# EAGLE design Versa64Cart_v1_4 (EAGLE 9.2.2)
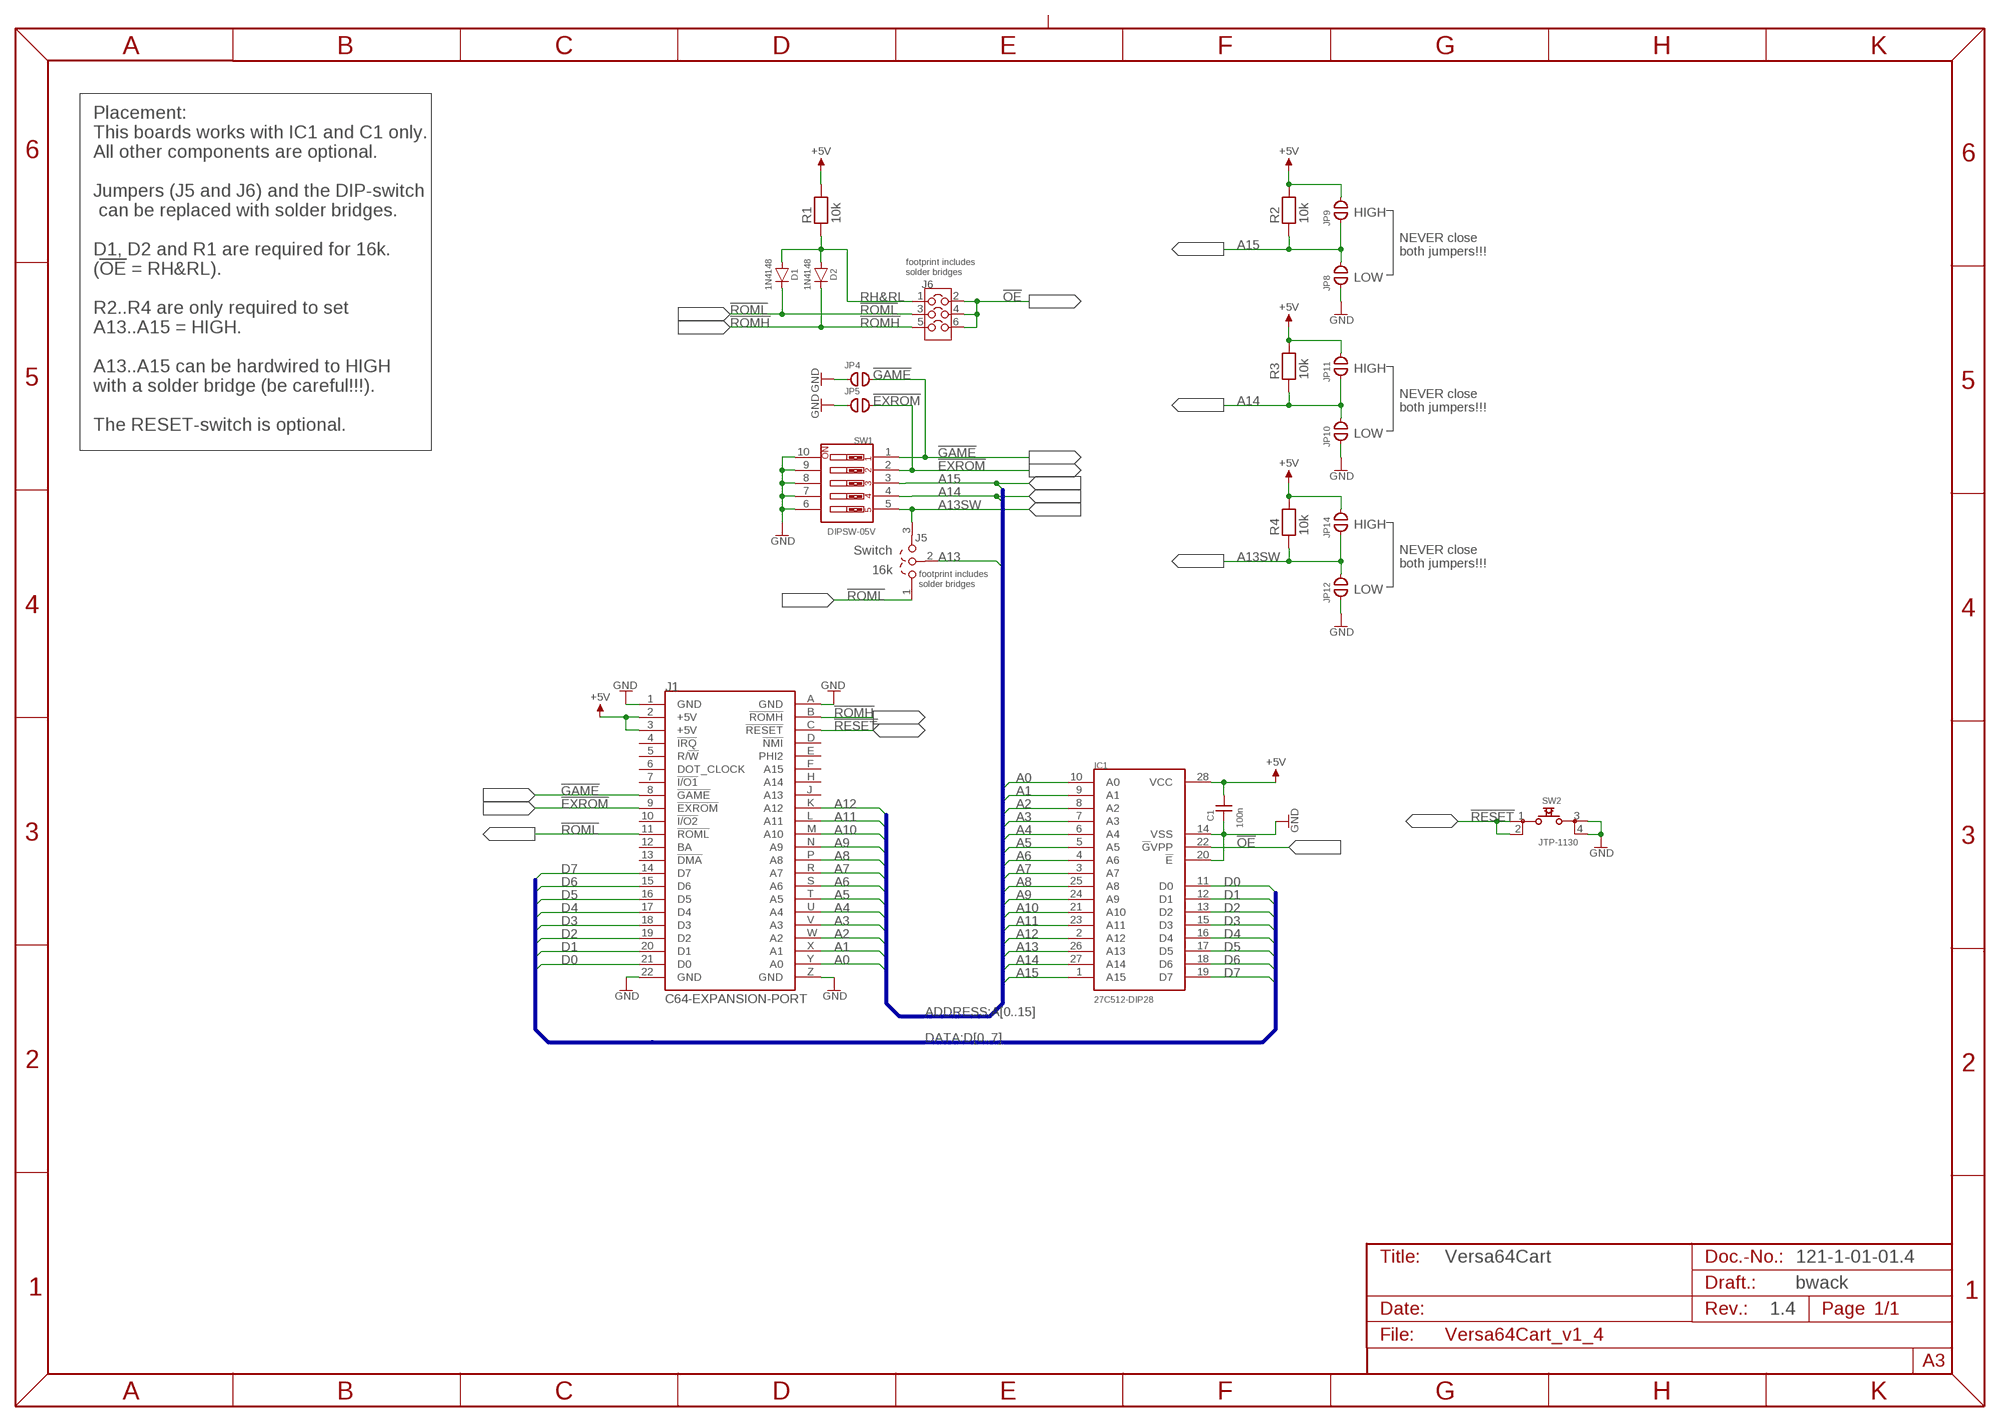
[diagram p0: schematic, sheet 1]

## Parts
C1  100n  CAP01  [C-2,5]
D1  1N4148  [DO-35]
D2  1N4148  [DO-35]
IC1  27C512-DIP28  M27C512-DIP28  [DIL28-6]
J1  C64-EXPANSION-PORT  C64-EXPANSIONPNARROW  [EXPANSIO_SQ]
J5  COMBI-3P  [COMBI-3P]
J6  COMBI-3X2P  [COMBI-3X2]
JP4  OPEN  [CP_OP]
JP5  OPEN  [CP_OP]
JP8  OPEN  [CP_OP]
JP9  OPEN  [CP_OP]
JP10  OPEN  [CP_OP]
JP11  OPEN  [CP_OP]
JP12  OPEN  [CP_OP]
JP14  OPEN  [CP_OP]
R1  10k  RES04  [R-10]
R2  10k  RES04  [R-10]
R3  10k  RES04  [R-10]
R4  10k  RES04  [R-10]
SW1  DIPSW-05V  [DIPSW-05V]
SW2  JTP-1130  [JTP-1130]

## Nets
!EXROM: J1.9(!EXROM) JP5.2 SW1.2
!GAME: J1.8(!GAME) JP4.2 SW1.1
!OE: IC1.22(!G!VPP) J6.2 J6.4 J6.6
!RESET: J1.C(!RESET) SW2.1 SW2.2
!ROMH: D2.K J1.B(!ROMH) J6.5
!ROML: D1.K J1.11(!ROML) J5.1 J6.3
+5V: C1.2 IC1.28(VCC) J1.2(+5V) J1.3(+5V) JP9.2 JP11.2 JP14.2 R1.2 R2.2 R3.2 R4.2
A0: IC1.10(A0) J1.Y(A0)
A1: IC1.9(A1) J1.X(A1)
A2: IC1.8(A2) J1.W(A2)
A3: IC1.7(A3) J1.V(A3)
A4: IC1.6(A4) J1.U(A4)
A5: IC1.5(A5) J1.T(A5)
A6: IC1.4(A6) J1.S(A6)
A7: IC1.3(A7) J1.R(A7)
A8: IC1.25(A8) J1.P(A8)
A9: IC1.24(A9) J1.N(A9)
A10: IC1.21(A10) J1.M(A10)
A11: IC1.23(A11) J1.L(A11)
A12: IC1.2(A12) J1.K(A12)
A13: IC1.26(A13) J5.2
A13SW: J5.3 JP12.2 JP14.1 R4.1 SW1.5
A14: IC1.27(A14) JP10.2 JP11.1 R3.1 SW1.4
A15: IC1.1(A15) JP8.2 JP9.1 R2.1 SW1.3
D0: IC1.11(D0) J1.21(D0)
D1: IC1.12(D1) J1.20(D1)
D2: IC1.13(D2) J1.19(D2)
D3: IC1.15(D3) J1.18(D3)
D4: IC1.16(D4) J1.17(D4)
D5: IC1.17(D5) J1.16(D5)
D6: IC1.18(D6) J1.15(D6)
D7: IC1.19(D7) J1.14(D7)
GND: C1.1 IC1.14(VSS) IC1.20(!E) J1.1(GND) J1.22(GND) J1.A(GND) J1.Z(GND) JP4.1 JP5.1 JP8.1 JP10.1 JP12.1 SW1.6 SW1.7 SW1.8 SW1.9 SW1.10 SW2.3 SW2.4
RH&RL: D1.A D2.A J6.1 R1.1
Unconnected: J1.4(!IRQ) J1.5(R/!W) J1.6(DOT_CLOCK) J1.7(!I/O1) J1.10(!I/O2) J1.12(BA) J1.13(!DMA) J1.D(!NMI) J1.E(PHI2) J1.F(A15) J1.H(A14) J1.J(A13)

## Buses
DATA:D[0..7]
ADDRESS:A[0..15]

## Notes on the sheet
- HIGH
- NEVER close
  both jumpers!!!
- footprint includes
  solder bridges
- LOW
- HIGH
- NEVER close
  both jumpers!!!
- Placement:
  This boards works with IC1 and C1 only. 
  All other components are optional.
  
  Jumpers (J5 and J6) and the DIP-switch
   can be replaced with solder bridges.
  
  D1, D2 and R1 are required for 16k. 
  (!OE! = RH&RL).
  
  R2..R4 are only required to set
  A13..A15 = HIGH.
  
  A13..A15 can be hardwired to HIGH 
  with a solder bridge (be careful!!!).
  
  The RESET-switch is optional.
- LOW
- HIGH
- Switch
- NEVER close
  both jumpers!!!
- 16k
- footprint includes
  solder bridges
- LOW
- Versa64Cart | 121-1-01-01.4
- bwack
- 1.4

## Library data of the parts
C1 = DISCRETE:CAP01
D1 D2 = Dioden:1N4148
IC1 = ST:M27C512
J1 = Commodore:C64-EXPANSIONP
J5 = Cutpad:COMBI-3P
J6 = Cutpad:COMBI-3X2P; SPICEPREFIX: X
JP4 JP5 JP8-JP12 JP14 = Cutpad:OPEN: open Cutpad
R1-R4 = DISCRETE:RES04
SW1 = DIPSWITCH:DIPSW-05
SW2 = Namae_Electronics:JTP-1130

## Board
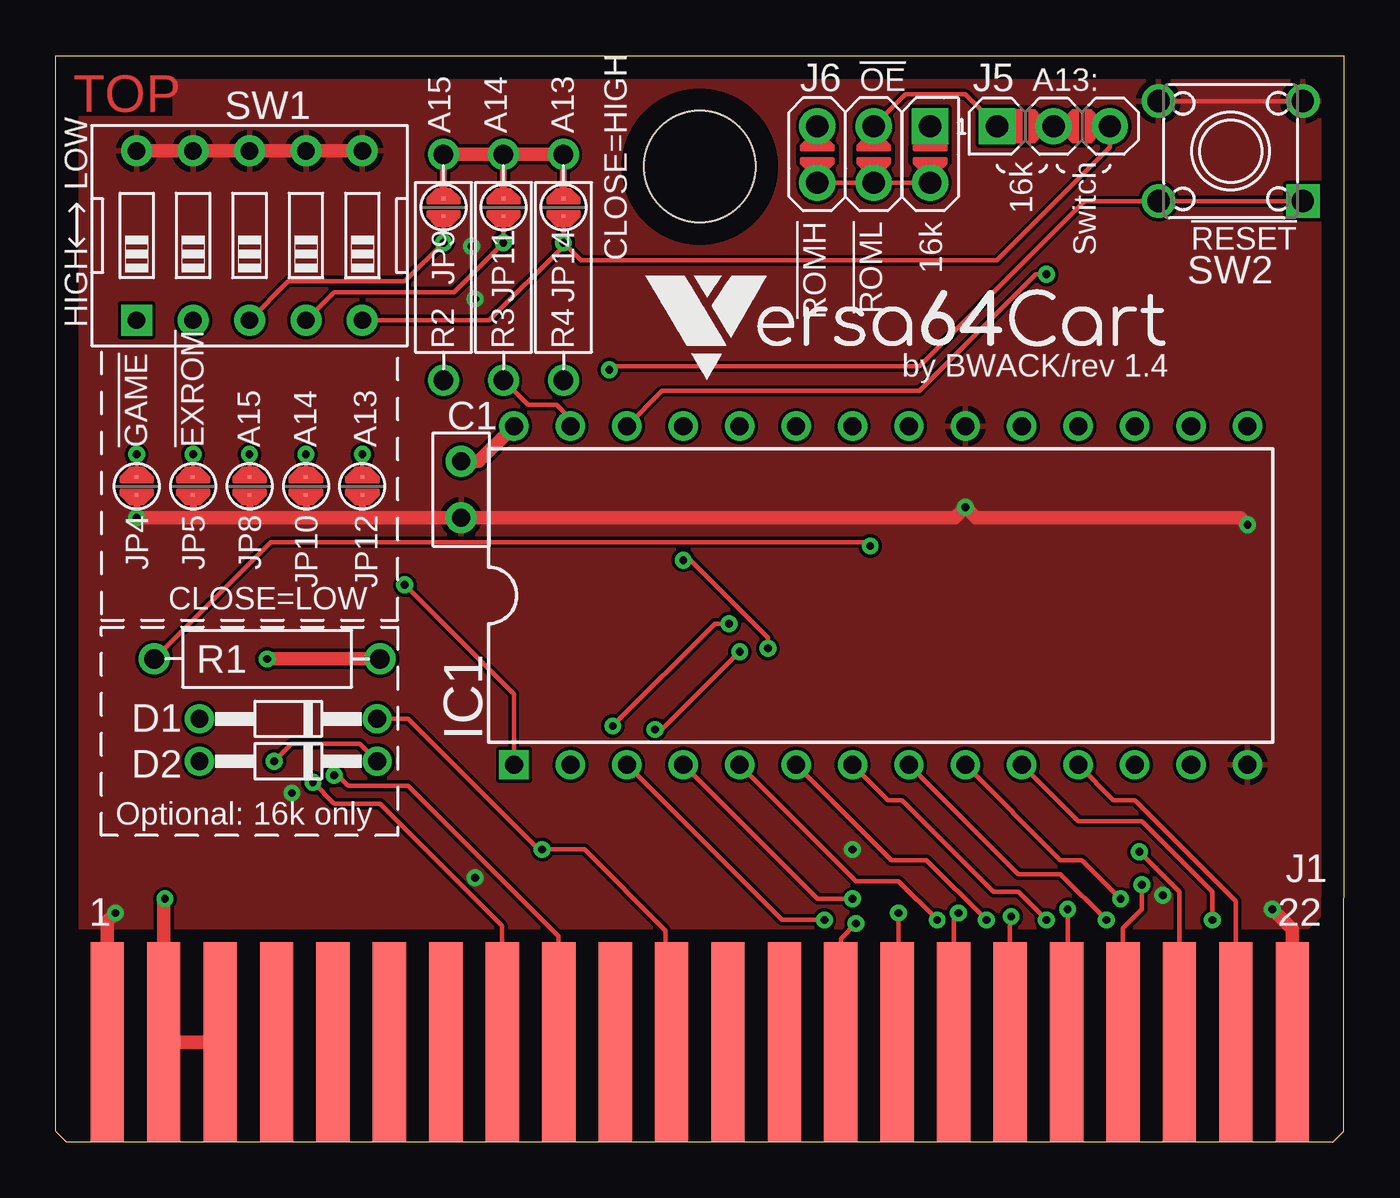
[diagram p1: board, top side]
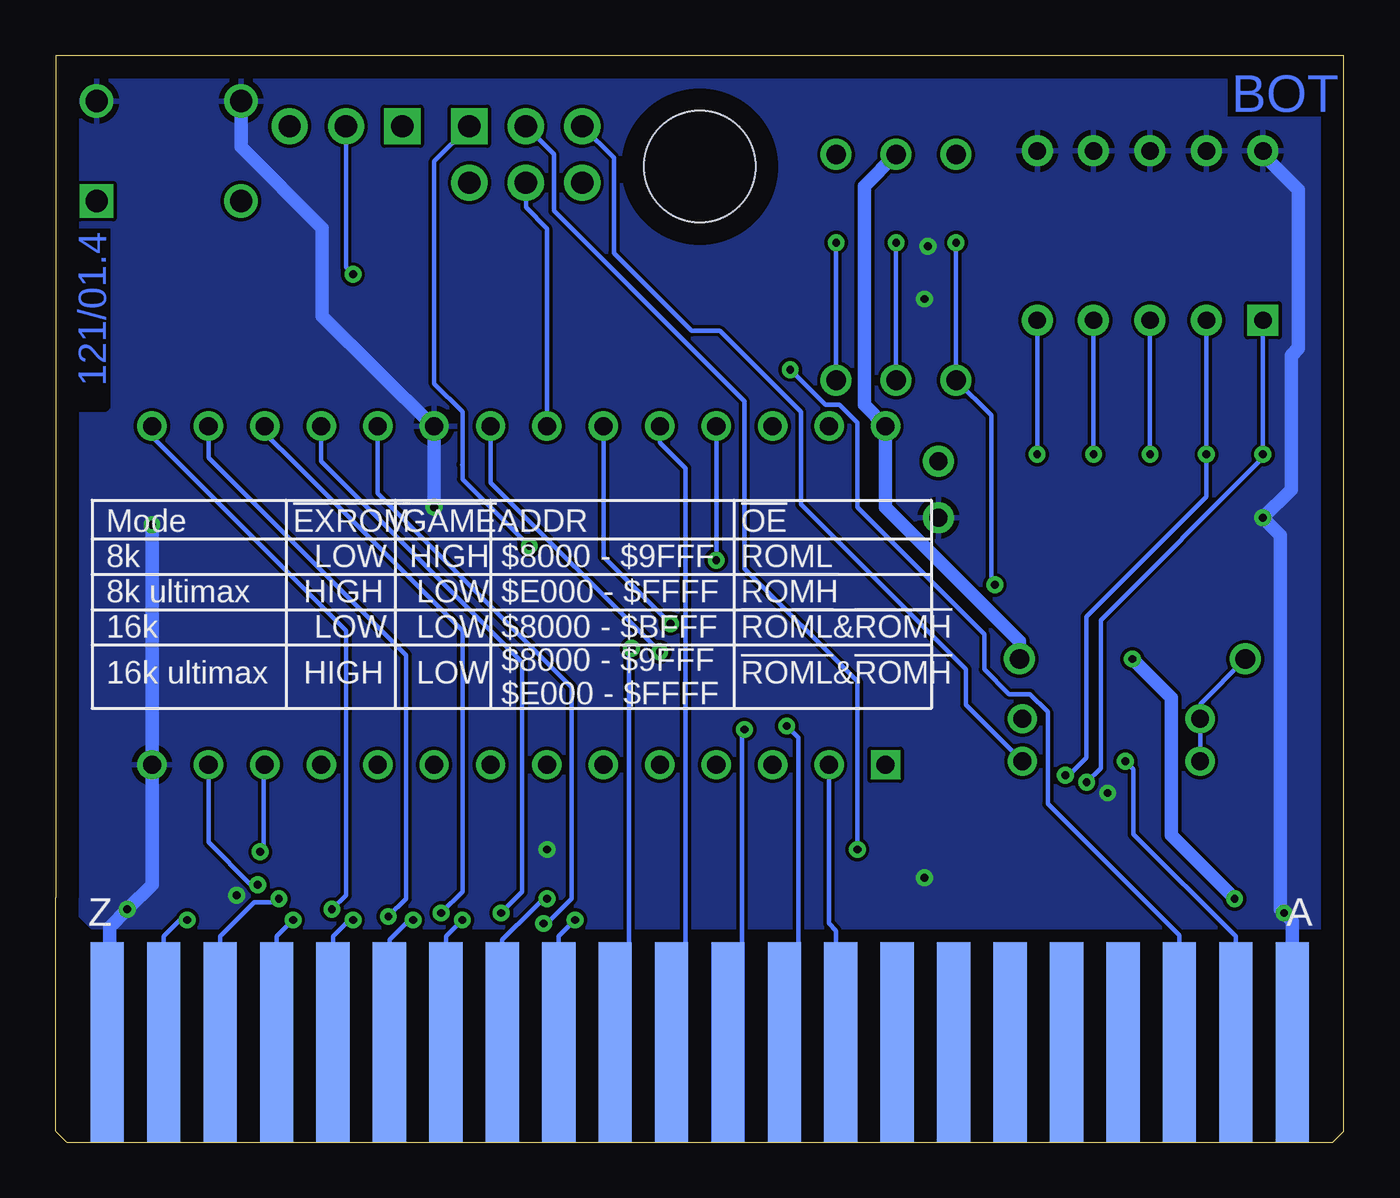
[diagram p2: board, bottom side, seen from below]

Size 58 x 48.9 mm. Coordinates in mm from the lower left corner, seen from the top.
Outline: 0,11 0,48.9 58,48.9 58,11
Copper layers (1*16): Top 0.035mm / dielectric 1.5mm / Bottom 0.035mm
Design rules "default *": minimum track width 6mil, minimum drill 0.35mm, track to track 6mil, track to pad 6mil, pad to pad 6mil, via to via 6mil, smd to smd 6mil, copper to edge 40mil, drill to drill 6mil, minimum pad ring 10mil, minimum via ring 8mil, stop-mask expansion 4mil, vias tented up to drill 24mil, thermal gap 10mil
Holes 5 mm at 29,43.9
bRestrict: 3 lines

### Footprints (pad centres in the part's own frame; a part is rotated, then mirrored left to right if it is on the bottom)
C-2,5 = drill 0.8 pad 1.397: 1 -1.27,0; 2 1.27,0
DO-35 = drill 0.8: A -4,0; K 4,0
DIL28-6 = drill 0.813 square: 1 -16.51,-7.62 | drill 0.813: 2 -13.97,-7.62; 3 -11.43,-7.62; 4 -8.89,-7.62; 5 -6.35,-7.62; 6 -3.81,-7.62; 7 -1.27,-7.62; 8 1.27,-7.62; 9 3.81,-7.62; 10 6.35,-7.62; 11 8.89,-7.62; 12 11.43,-7.62; 13 13.97,-7.62; 14 16.51,-7.62; 15 16.51,7.62; 16 13.97,7.62; 17 11.43,7.62; 18 8.89,7.62; 19 6.35,7.62; 20 3.81,7.62; 21 1.27,7.62; 22 -1.27,7.62; 23 -3.81,7.62; 24 -6.35,7.62; 25 -8.89,7.62; 26 -11.43,7.62; 27 -13.97,7.62; 28 -16.51,7.62
EXPANSIO_SQ = smd 1.5 x 9: 1 26.67,-4.5; 2 24.13,-4.5; 3 21.59,-4.5; 4 19.05,-4.5; 5 16.51,-4.5; 6 13.97,-4.5; 7 11.43,-4.5; 8 8.89,-4.5; 9 6.35,-4.5; 10 3.81,-4.5; 11 1.27,-4.5; 12 -1.27,-4.5; 13 -3.81,-4.5; 14 -6.35,-4.5; 15 -8.89,-4.5; 16 -11.43,-4.5; 17 -13.97,-4.5; 18 -16.51,-4.5; 19 -19.05,-4.5; 20 -21.59,-4.5; 21 -24.13,-4.5; 22 -26.67,-4.5 | smd 1.5 x 9 bottom: A 26.67,-4.5; B 24.13,-4.5; C 21.59,-4.5; D 19.05,-4.5; E 16.51,-4.5; F 13.97,-4.5; H 11.43,-4.5; J 8.89,-4.5; K 6.35,-4.5; L 3.81,-4.5; M 1.27,-4.5; N -1.27,-4.5; P -3.81,-4.5; R -6.35,-4.5; S -8.89,-4.5; T -11.43,-4.5; U -13.97,-4.5; V -16.51,-4.5; W -19.05,-4.5; X -21.59,-4.5; Y -24.13,-4.5; Z -26.67,-4.5
COMBI-3P = drill 1 pad 1.626 square: 1 -2.54,0 | drill 1 pad 1.626: 2 0,0; 3 2.54,0
COMBI-3X2 = drill 1 pad 1.626 square: 1 -1.27,2.54 | drill 1 pad 1.626: 2 1.27,2.54; 3 -1.27,0; 4 1.27,0; 5 -1.27,-2.54; 6 1.27,-2.54
CP_OP = smd 0.152 x 0.152: 1 -0.4,0; 2 0.4,0
R-10 = drill 0.889 pad 1.397: 1 -5.08,0; 2 5.08,0
DIPSW-05V = drill 0.787 pad 1.397 square: 1 -5.08,-3.81 | drill 0.787 pad 1.397: 2 -2.54,-3.81; 3 0,-3.81; 4 2.54,-3.81; 5 5.08,-3.81; 6 5.08,3.81; 7 2.54,3.81; 8 0,3.81; 9 -2.54,3.81; 10 -5.08,3.81
JTP-1130 = drill 1 square: 1 3.25,-2.25 | drill 1: 2 -3.25,-2.25; 3 3.25,2.25; 4 -3.25,2.25

### Placement (x,y rotation side)
C1  18.26,29.37 90 top
D1  10.48,19.05 0 top
D2  10.48,17.14 0 top
IC1  37.15,24.61 0 top
J1  29,0 180 top
J5  44.93,45.72 0 top
J6  36.83,44.45 270 top
JP4  3.65,29.53 90 top
JP5  6.19,29.53 90 top
JP8  8.73,29.53 90 top
JP9  17.46,42.07 90 top
JP10  11.27,29.53 90 top
JP11  20.16,42.07 90 top
JP12  13.81,29.53 90 top
JP14  22.86,42.07 90 top
R1  9.53,21.75 0 top
R2  17.46,39.37 90 top
R3  20.16,39.37 90 top
R4  22.86,39.37 90 top
SW1  8.73,40.8 0 top
SW2  52.9,44.6 0 top
U$39  [VERSA64CART]  26.51,34.29 0 top
U$40  [2LAYER]  0.79,46.35 0 top
U$41  [PCB-TITLE/]  0,60.96 0 top  (outside the outline)

### Tracks (layer width: path | path; a pad name or v marks a point on that pad's centre or on a via)
!EXROM  (via drill 0.35)
  Top 0.203: JP5.2 v6.19,30.96 | J1.9 22.65,9.26 15.88,16.03 13.18,16.03 12.7,16.51 v12.54,16.51
  Bottom 0.203: SW1.2 v6.19,30.96 6.19,29.05 11.59,23.65 11.59,17.3 12.38,16.51 v12.54,16.51
!GAME  (via drill 0.35)
  Top 0.203: JP4.2 v3.65,30.96 | J1.8 20.11,9.73 14.61,15.24 12.54,15.24 v11.59,16.19
  Bottom 0.2: v3.65,30.96 3.65,30.8 10.95,23.5
  Bottom 0.203: v3.65,30.96 SW1.1 | 10.95,23.5 10.95,16.83 v11.59,16.19
!OE
  Top 0.2: J6.6 J6.4 J6.2
  Bottom 0.2: J6.4 36.83,42.07 35.88,41.12 IC1.22
!RESET  (via drill 0.35)
  Top 0.2: v24.92,34.77 25.08,34.92 38.89,34.92 46.32,42.35 SW2.2
  Top 0.203: SW2.2 SW2.1
  Bottom 0.2: 13.34,15.24 13.34,19.37 14.13,20.16 15.08,20.16 16.19,21.27 16.19,22.86 21.91,28.57 21.91,29.53 21.91,32.38 22.7,33.18 23.34,33.18 v24.92,34.77
  Bottom 0.203: J1.C 7.41,9.31 13.34,15.24
!ROMH  (via drill 0.35)
  Top 0.203: v9.84,17.14 10.64,17.94 13.68,17.94 D2.K
  Bottom 0.2: 24.45,28.73 24.45,32.86 28.1,36.51 29.37,36.51 32.86,40.01 32.86,44.29 J6.5
  Bottom 0.203: J1.B 4.87,9.26 9.47,13.87 9.47,16.67 9.47,16.78 v9.84,17.14 | D2.K 17.02,19.68 17.02,21.27 24.45,28.7 24.45,28.73
!ROML  (via drill 0.35)
  Top 0.2: J5.1 40.96,47.15 38.26,47.15 J6.3
  Top 0.203: J1.11 27.46,4.77 27.46,9.53 23.81,13.18 v21.91,13.18 21.75,13.18 15.88,19.05 14.92,19.05 D1.K
  Bottom 0.2: v21.91,13.18 21.91,20.74 26.99,25.82 26.99,33.34 35.56,41.91 35.56,44.45 J6.3
+5V  (via drill 0.35)
  Top 0.305: JP9.2 R2.2 | JP11.2 R3.2 | JP14.2 R4.2
  Top 0.61: v4.92,10.95 4.87,10.9 J1.2 J1.3 | IC1.28 19.05,30.64 18.41,30.64 C1.2 | R4.2 R3.2 R2.2 | v9.53,21.75 R1.2
  Bottom 0.61: v4.92,10.95 7.78,13.81 7.78,17.78 7.78,20 v9.53,21.75 | R3.2 21.59,43.02 21.59,33.18 IC1.28 20.64,28.57 14.61,22.54 R1.2
A0  (via drill 0.35)
  Top 0.203: IC1.10 46.04,14.45 48.9,14.45 52.07,11.27 v52.07,10
  Bottom 0.203: v52.07,10 52.39,10 53.13,9.26 J1.Y
A1  (via drill 0.35)
  Top 0.203: v47.94,10.95 46.2,12.7 45.24,12.7 IC1.9
  Bottom 0.203: J1.X 50.59,9.26 50.01,9.84 49.05,10.79 48.26,10.79 48.1,10.95 v47.94,10.95
A2  (via drill 0.35)
  Top 0.203: v47.31,10 45.24,12.06 43.34,12.06 IC1.8
  Bottom 0.203: J1.W 48.05,9.26 v47.31,10
A3  (via drill 0.35)
  Top 0.203: IC1.7 37.47,15.4 38.1,15.4 42.23,11.27 43.34,11.27 v44.61,10
  Bottom 0.203: J1.V 45.51,9.26 44.77,10 v44.61,10
A4  (via drill 0.35)
  Top 0.203: v41.91,10 39.21,12.7 37.62,12.7 IC1.6
  Bottom 0.203: J1.U 42.97,9.1 42.07,10 v41.91,10
A5  (via drill 0.35)
  Top 0.203: v39.69,10 37.94,11.75 36.04,11.75 IC1.5
  Bottom 0.203: J1.T 40.43,9.26 v39.69,10
A6  (via drill 0.35)
  Top 0.203: v35.88,10.95 34.29,10.95 IC1.4
  Bottom 0.203: J1.S 37.89,9.1 36.51,10.48 36.04,10.95 v35.88,10.95
A7  (via drill 0.35)
  Top 0.203: v34.61,10 32.7,10 IC1.3
  Bottom 0.203: J1.R 35.35,9.26 v34.61,10
A8  (via drill 0.35)
  Top 0.203: v32.07,22.23 32.07,22.7 28.57,26.19 v28.26,26.19
  Bottom 0.203: v32.07,22.23 32.17,22.12 32.17,5.13 J1.P | IC1.25 v28.26,26.19
A9
  Bottom 0.203: J1.N 29.64,5.13 29.64,30.32 30.8,31.48 IC1.24
A10  (via drill 0.35)
  Top 0.203: v30.8,22.07 27.3,18.57 v26.99,18.57
  Bottom 0.203: v26.99,18.57 27.09,18.47 27.09,5.13 J1.M | v30.8,22.07 38.42,29.69 IC1.21
A11  (via drill 0.35)
  Top 0.203: v30.32,23.34 29.69,23.34 v25.08,18.73
  Bottom 0.203: v25.08,18.73 24.55,18.2 24.55,5.13 J1.L | IC1.23 33.34,26.35 v30.32,23.34
A12
  Bottom 0.203: J1.K 22.86,4.71 22.86,9.53 23.18,9.84 IC1.2
A13  (via drill 0.35)
  Top 0.2: IC1.26 27.3,33.81 38.89,33.81 44.13,39.05 v44.61,39.05 | v44.61,39.05 44.77,39.05 v44.61,39.05
  Bottom 0.2: v44.61,39.05 44.93,39.37 J5.2
A13SW  (via drill 0.35)
  Top 0.2: v22.86,40.48 23.65,39.69 42.39,39.69 47.47,44.77 J5.3 | JP12.2 v13.81,30.96
  Top 0.203: JP14.1 v22.86,40.48 22.86,40.32 19.53,36.99 SW1.5
  Bottom 0.203: SW1.5 v13.81,30.96 | R4.1 v22.86,40.48
A14  (via drill 0.35)
  Top 0.2: SW1.4 12.54,38.26
  Top 0.203: JP10.2 v11.27,30.96 | JP11.1 v20.16,40.48 17.94,38.26 12.54,38.26 | R3.1 21.27,33.18 22.54,33.18 23.18,32.54 IC1.27
  Bottom 0.203: v11.27,30.96 SW1.4 | R3.1 v20.16,40.48
A15  (via drill 0.35)
  Top 0.2: IC1.1 20.64,20.16 v15.72,25.08 | SW1.3 10.48,38.73
  Top 0.203: JP8.2 v8.73,30.96 | JP9.1 v17.46,40.48 15.72,38.73 10.48,38.73
  Bottom 0.203: v8.73,30.96 SW1.3 | v17.46,40.48 R2.1 15.88,32.7 15.88,25.08 v15.72,25.08
D0
  Top 0.203: J1.21 53.13,10.85 48.58,15.4 47.62,15.4 IC1.11
D1  (via drill 0.35)
  Top 0.203: v48.79,13.07 50.59,11.26 J1.20
  Bottom 0.203: v48.79,13.07 48.63,13.23 48.63,16.94 IC1.12
D2  (via drill 0.35)
  Top 0.203: J1.19 48.05,9.63 48.9,10.48 v48.9,11.59
  Bottom 0.203: v48.9,11.59 49.21,11.59 51.12,13.49 IC1.13
D3  (via drill 0.35)
  Top 0.203: J1.18 45.56,4.55 v45.56,10.48
  Bottom 0.203: v45.56,10.48 44.93,11.11 44.93,11.43 44.93,23.02 52.39,30.48 53.66,31.75 IC1.15
D4  (via drill 0.35)
  Top 0.203: J1.17 42.97,9.95 43.02,10 v43.02,10.16
  Bottom 0.203: v43.02,10.16 42.23,10.95 42.23,21.91 51.12,30.8 IC1.16
D5  (via drill 0.35)
  Top 0.203: J1.16 40.43,10.11 v40.64,10.32
  Bottom 0.203: v40.64,10.32 39.69,11.27 39.69,23.02 47.15,30.48 48.58,31.91 IC1.17
D6  (via drill 0.35)
  Top 0.203: J1.15 37.94,4.55 37.94,9.84 v37.94,10.32
  Bottom 0.203: v37.94,10.32 36.99,11.27 36.99,21.59 46.04,30.64 IC1.18
D7  (via drill 0.35)
  Top 0.203: J1.14 35.35,9.16 v36.04,9.84
  Bottom 0.203: v36.04,9.84 35.88,9.84 34.77,10.95 34.77,20.48 43.5,29.21 IC1.19
GND  (via drill 0.35)
  Top 0.203: SW2.3 SW2.4
  Top 0.305: JP4.1 v3.65,28.1 | JP5.1 6.19,28.1 | JP8.1 8.73,28.1 | JP10.1 11.27,28.1 | JP12.1 13.81,28.1
  Top 0.61: J1.A 2.33,9.95 v2.7,10.32 | v54.77,10.48 55.67,9.58 J1.22 | v3.65,28.1 6.19,28.1 8.73,28.1 11.27,28.1 13.81,28.1 C1.1 40.48,28.1 v40.96,28.57 41.43,28.1 53.34,28.1 v53.66,27.78 | SW1.10 SW1.9 SW1.8 SW1.7 SW1.6
  Bottom 0.61: J1.A 2.33,9.95 v2.7,10.32 2.86,10.48 2.86,27.3 v3.65,28.1 2.38,29.37 2.38,30.64 2.38,35.4 2.06,35.72 2.06,42.86 3.65,44.45 SW1.10 | J1.22 55.56,4.61 55.56,9.68 v54.77,10.48 53.66,11.59 IC1.14 v53.66,27.78 | v40.96,28.57 IC1.20 41.01,32.23 46,37.18 46,41.13 49.65,44.79 SW2.4
  other vias: 18.89,11.91 35.88,13.18 10.64,15.72 18.89,37.94 18.73,40.32 49.85,11.11
  pour Top: 0.64,48.26 0.64,10 0.95,9.68 56.36,9.68 57.15,10.48 57.15,48.26
  pour Bottom: 0.64,48.26 0.64,10 0.95,9.68 56.36,9.68 57.15,10.48 57.15,48.26
RH&RL  (via drill 0.35)
  Top 0.2: v36.67,26.83 36.51,26.99 9.68,26.99 R1.1
  Bottom 0.2: v36.67,26.83 39.69,29.84 39.69,30.48 39.7,30.5 39.69,30.51 39.69,32.86 40.96,34.13 40.96,44.13 J6.1 | R1.1 6.48,19.72 D1.A
  Bottom 0.203: D2.A D1.A

### Text on the board
Bottom: 121/01.4
tPlace: !OE | A13: | A15 | A14 | A13 | 16k | Switch | LOW | !ROMH | !ROML | 16k | CLOSE=HIGH | !RESET | HIGH | by BWACK/rev 1.4 | !GAME | !EXROM | A15 | A14 | A13 | CLOSE=LOW | Optional: 16k only
bPlace: !OE | ADDR | !GAME | !EXROM | Mode | !ROML | $8000 - $9FFF | HIGH | LOW | 8k | !ROMH | $E000 - $FFFF | LOW | HIGH | 8k ultimax | !ROML!&!ROMH | $8000 - $BFFF | LOW | LOW | 16k | !ROML!&!ROMH | LOW | HIGH | 16k ultimax | $8000 - $9FFF / $E000 - $FFFF
Measures: 5.0
Document: 121-2-01-01.4 | BWACK | 35µm | 2 | 1.4